# Altium schematic sheet Power.SchDoc
size A4; SheetNumber: 1; SheetTotal: 5
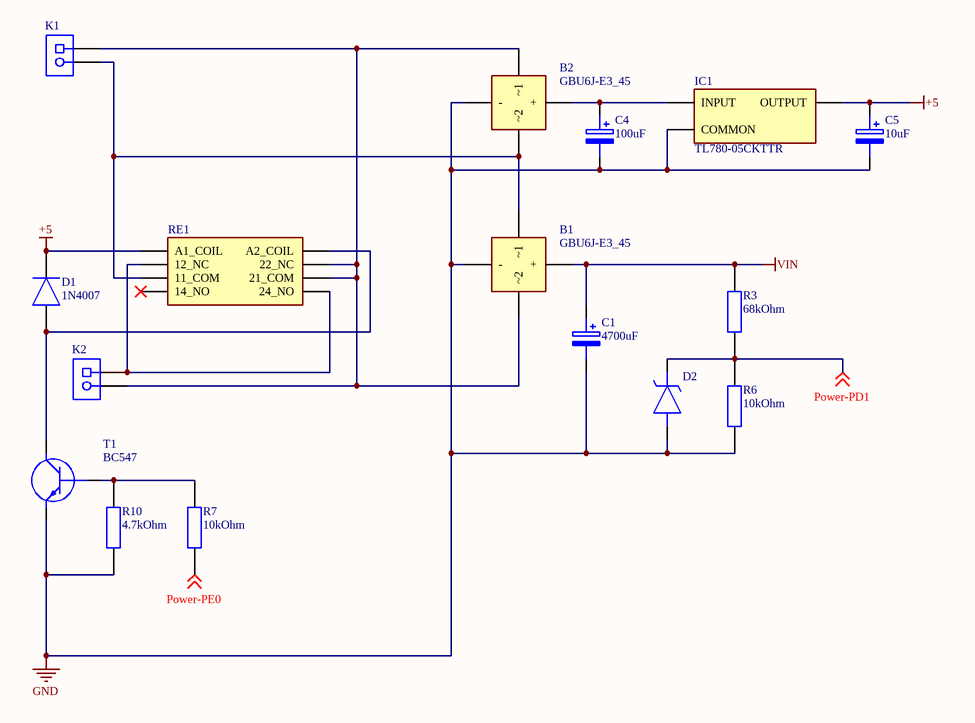
[diagram p0: Power.SchDoc]

## Parts
B1  GBU6J-E3_45  [GBU6JE345]
B2  GBU6J-E3_45  [GBU6JE345]
C1  4700uF  [4700uF capacitor]
C4  100uF  [100uF capacitor]
C5  10uF  [10uF capacitor]
D1  1N4007  [0.77mm lead diode]
D2  1N5231B  [0.5mm lead diode]  (value not drawn)
IC1  TL780-05CKTTR  [TL78005CKTTR]
K1  1729128  [2-pin terminal block]  (value not drawn)
K2  1729128  [2-pin terminal block]  (value not drawn)
R3  68kOhm  [resistor]
R6  10kOhm  [resistor]
R7  10kOhm  [resistor]
R10  4.7kOhm  [resistor]
RE1  RT424005  [RT42]  (value not drawn)
T1  BC547  [BC547CBU]

## Nets
+5: C5.1(+) D1.1(K) IC1.3(OUTPUT) RE1.1(A1_COIL)
GND: B1.4(-) B2.4(-) C1.2(-) C4.2(-) C5.2(-) D2.2(A) IC1.2(COMMON) R6.1 R10.1 T1.3(E)
VIN: B1.1(+) C1.1(+) R3.2
Power-PD1: D2.1(K) R3.1 R6.2 ; off-sheet Power-PD1
Power-PE0: R7.1 ; off-sheet Power-PE0
NetB1_2: B1.2(~1) B2.3(~2) K1.2 RE1.3(11_COM)
NetB1_3: B1.3(~2) B2.2(~1) K1.1 K2.2 RE1.6(21_COM) RE1.7(22_NC)
NetB2_1: B2.1(+) C4.1(+) IC1.1(INPUT)
NetD1_2: D1.2(A) RE1.8(A2_COIL) T1.1(C)
NetK2_1: K2.1 RE1.2(12_NC) RE1.5(24_NO)
NetR7_2: R7.2 R10.2 T1.2(B)

Not connected (* = marked no-connect by the designer): RE1 4(14_NO)*

## Library data of the parts
B1 B2 = GBU6J-E3_45: Bridge Rectifier; Manufacturer_Name: Vishay; Manufacturer_Part_Number: GBU6J-E3/45; Datasheet Link: http://www.vishay.com/docs/88615/gbu6a.pdf; Height: 18.8mm
C1 = 4700uF capacitor: Capacitor Polarised; Manufacturer_Name: Nichicon; Manufacturer_Part_Number: UVR1H472MRD; Datasheet Link: https://www.mouser.co.uk/datasheet/2/293/e-vr-6088.pdf; Height: 42mm
C4 = 100uF capacitor: Capacitor Polarised; Manufacturer_Name: Kemet; Manufacturer_Part_Number: ESK107M050AG3EA; Height: 12.5mm
C5 = 10uF capacitor: Capacitor Polarised; Manufacturer_Name: Panasonic; Manufacturer_Part_Number: ECA-1HM100B; Datasheet Link: https://componentsearchengine.com//ECA-1HM100B.pdf; Height: 12mm; Mouser2 Part Number: 667-ECA-1HM100B; Mouser2 Price/Stock: https://www.mouser.com/Search/Refine.aspx?Keyword=667-ECA-1HM100B
D1 = 1N4007: Diode; Manufacturer_Name: Diotec; Datasheet Link: https://diotec.com/tl_files/diotec/files/pdf/datasheets/1n4001.pdf; Manufacturer_Part_Number: 1N4007; Mouser Part Number: 637-1N4007; Mouser Price/Stock: https://www.mouser.co.uk/ProductDetail/Diotec-Semiconductor/1N4007?qs=OlC7AqGiEDmK9mU1uTiCkg%3D%3D; Arrow Part Number: 1N4007; Arrow Price/Stock: https://www.arrow.com/en/products/1n4007/diotec-semiconductor-ag?region=europe
D2 = 1N5231B: Zener Diode; Manufacturer_Name: ON Semiconductor; Manufacturer_Part_Number: 1N5231B
IC1 = TL780-05CKTTR: DC Converter; Manufacturer_Name: Texas Instruments; Datasheet Link: http://www.ti.com/general/docs/suppproductinfo.tsp?distId=26&gotoUrl=http%3A%2F%2Fwww.ti.com%2Flit%2Fgpn%2Ftl780; Height: 5.08mm; Manufacturer_Part_Number: TL780-05CKTTR
K1 K2 = MKDSN 1,5/ 2-5,08: PCB Terminal Block, 13.5 A, 400 V, 2-Pin THD, RoHS, Bulk; Manufacturer: Phoenix Contact; Package Version: 03/2015; No. of Rows: 1; Pitch: 5.08mm; No. of Positions: 2; Voltage Rating: 400V; Current Rating: 13500mA; Manufacturer URL: http://www.phoenixcontact.com/; Datasheet URL: https://datasheet.ciiva.com/16046/1729128-16046181.pdf; RoHS: TRUE; Package URL: https://www.phoenixcontact.com/online/portal/pi/pxc/product_detail_page/!ut/p/b1/3VdJjqNKFDxLH8AFycySyWY2ozFsEPOMMQaDOX1XedGL_1Vdm5YXJleknhSKeBkvI6EA8ncAo3AYoDhBQGco6KN7VURTdemj9us_IEKEZo_YHiPAEWEFmDGOHMORkqKYCORBZxgL7ZoaZYcbFFUZ3fqxSY6GOuxydWUuHqz1ynmMFygu583Bob0Ewr6Sd_l-5m-kAueHiB0jpRwZwe58wwtkpxtMYd_LmGcDRU02dRNEyWt6Y2ti5pSyJ_reIkzIulrqApdnbT11V5jnCKbYNCvhEM1MCpPByat_X379-iThf08CI5GfOPqfBeS3BRoBOdD55AKVv0iLwCMq-2BrzXWSGRH7pUGD9uwXQjiph3xL0DKQwdGa0JImiIOmBNOestqgwTHSSs2oOep-78apyXQBvNi8ZLaFjvjWvcaUEBu0MC6Wbe-d6mB0FAebo2lUWinqYaZs5DAYzV0RP9yitUjnGJ0iI9xhZkT42OCQNUJJhkgWINNQLP2JFP6OpMg3JCVg70jqHT0lvKOnhHf0lPuOnnLf0VPuWx6_dxwUIvwk5WMkT0kLL1mh61l2yZVSzG3pYV_bqo-mj6uMKwKwdnnW8Jh5RTOJzMOA5c-eJDaZQw4mTMPH02PvS_ZAqNVjVTo2WyYLkwH_KU1mmmG5kjRhDqPXLwwVHvVOjCM60-fpXvTDfMGW1PVFVS1r4e4yVDk4ZdNbkUHvqPqQSeian4UD39fNKmachqdJ1NJbyk8rXT9mXTvPk3oE5meulKGgiruPJek-4I9hTT6G8ZLOyRSm2RRVbThERQad5OS28hdt4YW4vG0stgYYzsWsK4_7y6DZMjJSCqri1kyiZR5vD7pwIrNR7QwPHTcLTI5qT7eRlpHrdGiupYlqQDJ7zy_CND8fWWBoLRXxk1RVcXiBQwbTD4Xi7KL-FuO94t9xaqweXzH; PartNumber: 1729128; Package Description: 2-Pin Through Hole Device, Body 8.1 x 10.16 mm, Pitch 5.08 mm; Datasheet Version: 12/2013; Mounting Technology: ThroughHole; Orientation: Horizontal; Package Reference: 1729128-2; Packing: Bulk
R3 = 68kOhm resistor: Resistor; Manufacturer_Name: YAGEO (PHYCOMP); Manufacturer_Part_Number: CFR-25JR-52-68K; Datasheet Link: https://componentsearchengine.com/Datasheets/1/CFR-25JR-52-68K.pdf
R6 = 10kOhm resistor: Resistor; Manufacturer_Name: YAGEO (PHYCOMP); Manufacturer_Part_Number: CFR-25JT-52-10K
R7 = 10kOhm: Resistor; Manufacturer_Name: YAGEO (PHYCOMP); Manufacturer_Part_Number: CFR-25JT-52-10K
R10 = 4.7kOhm: Resistor; Manufacturer_Name: YAGEO (PHYCOMP); Manufacturer_Part_Number: CFR-25JT-52-4K7; Datasheet Link: https://componentsearchengine.com//CFR-25JT-52-4K7.pdf; Mouser2 Part Number: 603-CFR-25JT-52-4K7; Mouser2 Price/Stock: https://www.mouser.com/Search/Refine.aspx?Keyword=603-CFR-25JT-52-4K7
RE1 = RT424005: Relay; Manufacturer_Name: TE Connectivity; Datasheet Link: https://componentsearchengine.com//RT424005.pdf; Mouser2 Part Number: 655-RT424005; Mouser2 Price/Stock: https://www.mouser.com/Search/Refine.aspx?Keyword=655-RT424005; Manufacturer_Part_Number: RT424005
T1 = BC547: Transistor BJT NPN; Manufacturer_Name: ON Semiconductor; Datasheet Link: https://www.onsemi.com/pdf/datasheet/bc550-d.pdf; Height: 5.33mm; Manufacturer_Part_Number: BC547CBU